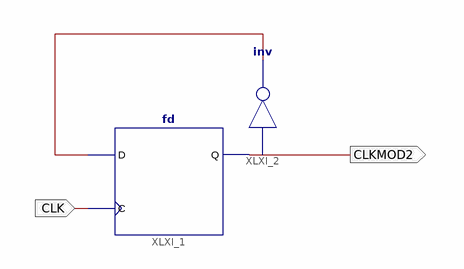
[diagram p0: schematic sheet 1]
// Xilinx ISE schematic mod2.sch (spartan6) as structural Verilog: 2 symbols, 2 ports
module mod2 (
  input  CLK,
  output CLKMOD2
);

  wire XLXN_3;

  fd XLXI_1 (.C(CLK), .D(XLXN_3), .Q(CLKMOD2));
  not XLXI_2 (XLXN_3, CLKMOD2);
endmodule
